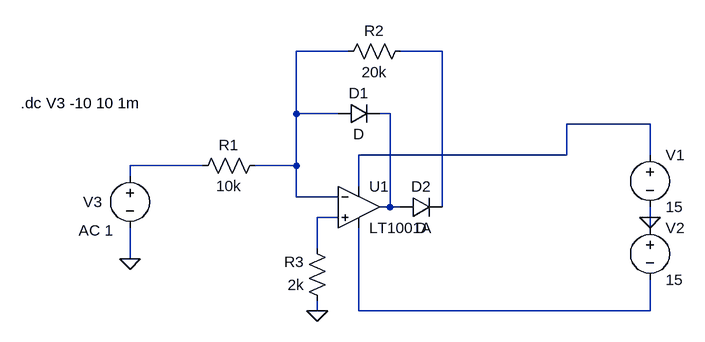
[diagram p0: schematic Rectificador.asc]
Rectificador.asc, the LTspice schematic file:
Version 4
SHEET 1 880 680
WIRE 304 -128 224 -128
WIRE 448 -128 384 -128
WIRE 224 -32 224 -128
WIRE 288 -32 224 -32
WIRE 368 -32 352 -32
WIRE 768 -16 640 -16
WIRE 640 32 640 -16
WIRE 640 32 320 32
WIRE 768 32 768 -16
WIRE 80 48 -32 48
WIRE 224 48 224 -32
WIRE 224 48 160 48
WIRE -32 64 -32 48
WIRE 320 80 320 32
WIRE 224 96 224 48
WIRE 288 96 224 96
WIRE 368 112 368 -32
WIRE 368 112 352 112
WIRE 384 112 368 112
WIRE 448 112 448 -128
WIRE 288 128 256 128
WIRE 768 128 768 112
WIRE 768 144 768 128
WIRE 256 176 256 128
WIRE -32 192 -32 144
WIRE 256 272 256 256
WIRE 320 272 320 144
WIRE 768 272 768 224
WIRE 768 272 320 272
FLAG -32 192 0
FLAG 256 272 0
FLAG 768 128 0
SYMBOL res 272 272 R180
WINDOW 0 36 76 Left 2
WINDOW 3 36 40 Left 2
SYMATTR InstName R3
SYMATTR Value 2k
SYMBOL voltage 768 16 R0
WINDOW 123 0 0 Left 2
WINDOW 39 0 0 Left 2
SYMATTR InstName V1
SYMATTR Value 15
SYMBOL voltage 768 128 R0
WINDOW 123 0 0 Left 2
WINDOW 39 0 0 Left 2
SYMATTR InstName V2
SYMATTR Value 15
SYMBOL Opamps\\LT1001A 320 48 R0
SYMATTR InstName U1
SYMBOL voltage -32 48 R0
WINDOW 0 -72 56 Left 2
WINDOW 3 -301 -26 Invisible 2
WINDOW 123 -79 100 Left 2
WINDOW 39 0 0 Left 2
SYMATTR InstName V3
SYMATTR Value 1
SYMATTR Value2 AC 1
SYMBOL res 400 -144 R90
WINDOW 0 0 56 VBottom 2
WINDOW 3 32 56 VTop 2
SYMATTR InstName R2
SYMATTR Value 20k
SYMBOL diode 288 -16 R270
WINDOW 0 32 32 VTop 2
WINDOW 3 0 32 VBottom 2
SYMATTR InstName D1
SYMBOL diode 384 128 R270
WINDOW 0 32 32 VTop 2
WINDOW 3 0 32 VBottom 2
SYMATTR InstName D2
SYMBOL res 176 32 R90
WINDOW 0 0 56 VBottom 2
WINDOW 3 32 56 VTop 2
SYMATTR InstName R1
SYMATTR Value 10k
TEXT -200 -48 Left 2 !.dc V3 -10 10 1m

The netlist it stands for:
* Rectificador.asc
R3 0 N006 2k
V1 N004 0 15
V2 0 N007 15
XU1 N006 N001 N004 N007 N003 LT1001  ; LT1001A, pins In+ In- V+ V- OUT
V3 N005 0 1 AC 1
R2 N002 N001 20k
D1 N001 N003 D
D2 N003 N002 D
R1 N001 N005 10k
.model D D
.lib standard.dio
.dc V3 -10 10 1m
.lib LTC.lib
.backanno
.end